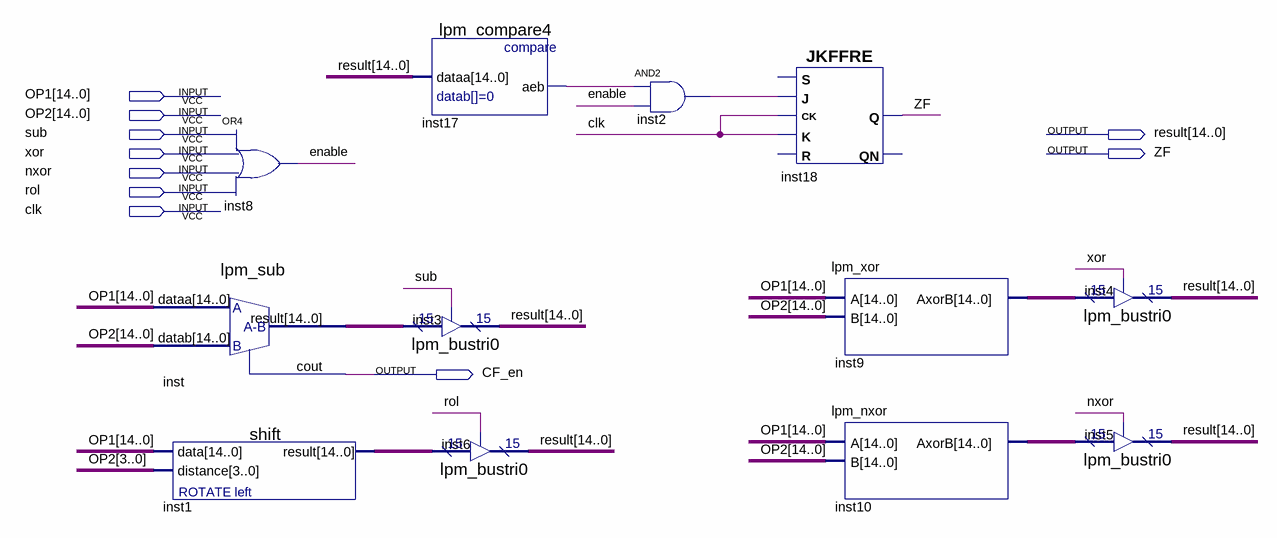
[diagram p0: schematic sheet]
// Quartus schematic ALU.bdf as structural Verilog: 12 symbols, 10 pins
module ALU (
  input  [14:0] OP1,
  input  [14:0] OP2,
  input  sub,
  input  \xor ,
  input  nxor,
  input  rol,
  input  clk,
  output [14:0] result,
  output ZF,
  output CF_en
);

  wire enable, inst2_out, inst17_aeb;
  wire [14:0] inst1_result, inst9_axorb, inst10_axorb, inst_result;

  lpm_sub inst (.dataa(OP1), .datab(OP2), .result(inst_result), .cout(CF_en));
  shift inst1 (.data(OP1), .distance(OP2[3:0]), .result(inst1_result));
  or inst8 (enable, sub, \xor , nxor, rol);
  lpm_compare4 inst17 (.dataa(result), .aeb(inst17_aeb));
  lpm_bustri0 inst3 (.enabledt(sub), .data(inst_result), .tridata(result));
  lpm_bustri0 inst6 (.enabledt(rol), .data(inst1_result), .tridata(result));
  and inst2 (inst2_out, inst17_aeb, enable);
  JKFFRE inst18 (.K(clk), .CK(clk), .J(inst2_out), .Q(ZF));  // open: R, S, QN
  lpm_xor inst9 (.A(OP1), .B(OP2), .AxorB(inst9_axorb));
  lpm_nxor inst10 (.A(OP1), .B(OP2), .AxorB(inst10_axorb));
  lpm_bustri0 inst4 (.enabledt(\xor ), .data(inst9_axorb), .tridata(result));
  lpm_bustri0 inst5 (.enabledt(nxor), .data(inst10_axorb), .tridata(result));
endmodule
